# EAGLE design LedKeychain-v2 (EAGLE 7.3.0)
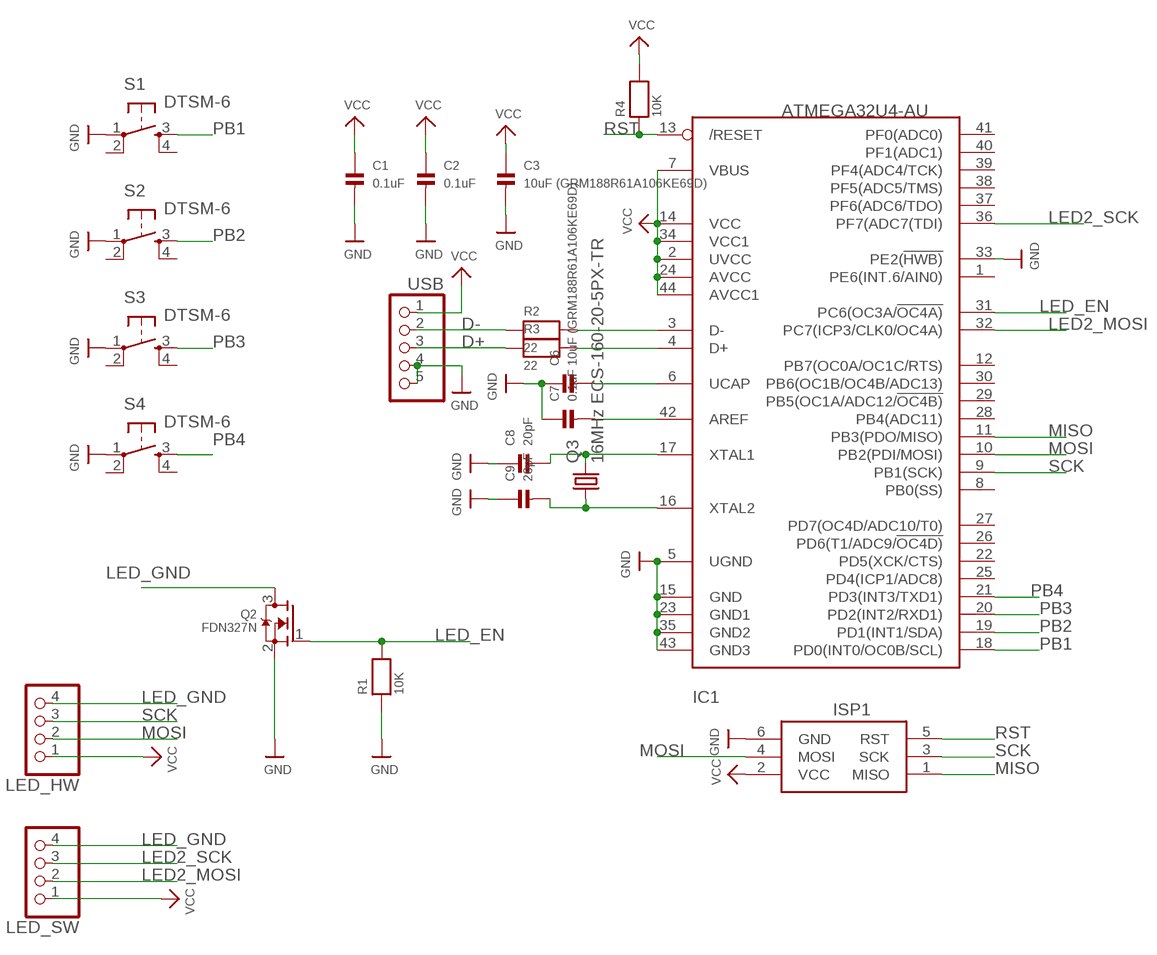
[diagram p0: schematic, sheet 1]

## Parts
C1  0.1uF  CAP_CERAMIC0603MINI  [0603-MINI]
C2  0.1uF  CAP_CERAMIC0603MINI  [0603-MINI]
C3  10uF (GRM188R61A106KE69D)  CAP_CERAMIC1206  [1206]
C6  10uF (GRM188R61A106KE69D)  CAP_CERAMIC1206  [1206]
C7  0.1uF  CAP_CERAMIC0603MINI  [0603-MINI]
C8  20pF  CAP_CERAMIC0603MINI  [0603-MINI]
C9  20pF  CAP_CERAMIC0603MINI  [0603-MINI]
IC1  ATMEGA32U4-AU  [TQFP44]
ISP1  AVRISP-6  [AVRISP]
LED_HW  HEADER-1X4ROUND  [1X04_ROUND]
LED_SW  HEADER-1X4ROUND  [1X04_ROUND]
Q2  FDN327N  MOSFET-NWIDE  [SOT23-WIDE]
Q3  16MHz ECS-160-20-5PX-TR  CRYSTALHC49UP  [HC49UP]
R1  10K  RESISTOR0603MINI  [0603-MINI]
R2  22  RESISTOR0603MINI  [0603-MINI]
R3  22  RESISTOR0603MINI  [0603-MINI]
R4  10K  RESISTOR0603MINI  [0603-MINI]
S1  DTSM-6  [DTSM-6]
S2  DTSM-6  [DTSM-6]
S3  DTSM-6  [DTSM-6]
S4  DTSM-6  [DTSM-6]
USB  PINHD-1X5/90  [1X05/90]

## Nets
D+: R3.1 USB.3
D-: R2.1 USB.2
GND: C1.2 C2.2 C3.2 C6.1 C7.1 C8.1 C9.1 IC1.5(UGND) IC1.15(GND) IC1.23(GND1) IC1.33(PE2(!HWB)) IC1.35(GND2) IC1.43(GND3) ISP1.6(GND) Q2.2(S) R1.1 S1.1 S2.1 S3.1 S4.1 USB.4 USB.5
LED2_MOSI: IC1.32(PC7(ICP3/CLK0/OC4A)) LED_SW.2
LED2_SCK: IC1.36(PF7(ADC7(TDI)) LED_SW.3
LED_EN: IC1.31(PC6(OC3A/!OC4A)) Q2.1(G) R1.2
LED_GND: LED_HW.4 LED_SW.4 Q2.3(D)
MISO: IC1.11(PB3(PDO/MISO)) ISP1.1(MISO)
MOSI: IC1.10(PB2(PDI/MOSI)) ISP1.4(MOSI) LED_HW.2
N$3: IC1.3(D-) R2.2
N$4: IC1.4(D+) R3.2
N$5: C6.2 IC1.6(UCAP)
N$6: C7.2 IC1.42(AREF)
N$7: C9.2 IC1.16(XTAL2) Q3.1
N$8: C8.2 IC1.17(XTAL1) Q3.2
PB1: IC1.18(PD0(INT0/OC0B/SCL)) S1.3
PB2: IC1.19(PD1(INT1/SDA)) S2.3
PB3: IC1.20(PD2(INT2/RXD1)) S3.3
PB4: IC1.21(PD3(INT3/TXD1)) S4.3
RST: IC1.13(/RESET) ISP1.5(RST) R4.1
SCK: IC1.9(PB1(SCK)) ISP1.3(SCK) LED_HW.3
VCC: C1.1 C2.1 C3.1 IC1.2(UVCC) IC1.7(VBUS) IC1.14(VCC) IC1.24(AVCC) IC1.34(VCC1) IC1.44(AVCC1) ISP1.2(VCC) LED_HW.1 LED_SW.1 R4.2 USB.1
Unconnected: IC1.1(PE6(INT.6/AIN0)) IC1.8(PB0(SS)) IC1.12(PB7(OC0A/OC1C/RTS)) IC1.22(PD5(XCK/CTS)) IC1.25(PD4(ICP1/ADC8)) IC1.26(PD6(T1/ADC9/!OC4D)) IC1.27(PD7(OC4D/ADC10/T0)) IC1.28(PB4(ADC11)) IC1.29(PB5(OC1A/ADC12/!OC4B)) IC1.30(PB6(OC1B/OC4B/ADC13)) IC1.37(PF6(ADC6/TDO)) IC1.38(PF5(ADC5/TMS)) IC1.39(PF4(ADC4/TCK)) IC1.40(PF1(ADC1)) IC1.41(PF0(ADC0)) S1.2 S1.4 S2.2 S2.4 S3.2 S3.4 S4.2 S4.4

## Library data of the parts
C1-C3 C6-C9 = microbuilder:CAP_CERAMIC: Ceramic Capacitors 0402 - 0402 Surface Mount Capacitors 16pF 50V 5% [Digikey: 445-4899-2-ND] 18pF 50V 5% [Digikey: 490-1281-2-ND] 22pF 50V 5% [Digikey: 490-1283-2-ND] 68pF 50V 5% [Digikey: 490-1289-2-ND] 0.1uF 10V 10% [Digikey: 490-1318-2-ND] 1.0uF 6.3V 10% [Digikey: 490-1320-2-ND] 0603 - 0603 Surface Mount Capacitors 16 pF 50V 5% [Digikey: 445-5051-2-ND] 22 pF 50V [Digikey: PCC220ACVTR-ND] 33 pF 50V 5% [Digikey: 490-1415-1-ND] 56pF 50V 5% [Digikey: 490-1421-1-ND] 220pF 50V 5% [Digikey: 445-1285-1-ND] 680 pF 50V 2200 pF 50V 5% C0G [Digikey: 445-1297-1-ND] 5600 pF 100V 5% X7R [Digikey: 478-3711-1-ND] 0.1 µF 25V 10% [Digikey: PCC2277TR-ND] 0.22 µF 16V 10% X7R [Digikey: 445-1318-1-ND] 1.0 µF 25V 10% [Digikey: 445-5146-2-ND] 0603 - RF Specific 3pF 250V +/-0.1pF RF [Digikey: 712-1347-1-ND] 18 pF 250V 5% [Digikey: 478-3505-1-ND or 712-1322-1-ND] 56 pF 250V 5% C0G RF [Digikey: 490-4867-1-ND] 68 pF 250V RF [Digikey: 490-4868-1-ND] 0805 - 0805 Surface Mount Capacitors 220 pF 250V 2% RF Ceramic Capacitor [Digikey: 712-1398-1-ND] 1000 pF 50V 2% NP0 Ceramic Capacitor [Digikey: 478-3760-1-ND] 0.1 µF 25V 10% Ceramic Capacitor [Digikey: PCC1828TR-ND] 1.0 µF 16V 10% Ceramic Capacitor[Digikey: 490-1691-2-ND] 10.0 µF 10V 10% Ceramic Capacitor[Digikey: 709-1228-1-ND] 10.0 uF 16V 10% Ceramic Capacitor [Digikey: 478-5165-2-ND] 47 uF 6.3V 20% Ceramic Capacitor [Digikey: 587-1779-1-ND or 399-5506-1-ND] 1206 - 1206 Surface Mount Capacitors 47uF 10V 20% Ceramic Capacitor [Digikey: 490-5528-1-ND or 399-5508-1-ND or 445-6010-1-ND] 100uF 6.3V -20%, +80% Y5V Ceramic Capacitor (Digikey: 490-4512-1-ND, Mouser: 81-GRM31CF50J107ZE1L)
IC1 = adafruit:ATMEGA32U4: http://www.ladyada.net/library/eagle
ISP1 = adafruit:AVRISP: AVR ISP HEADER Standard 6 pin header for AVR programming
LED_HW LED_SW = microbuilder:HEADER-1X4: PIN HEADER
Q2 = microbuilder:MOSFET-N: N-Channel Mosfet LEGEND VDS: Voltage Drain-Source ID: Drain Current RDS(ON): Drain-Source On-State Resistance VGS(TH): Gate-Source Threshold Voltage CISS: Drain-Source Input Capacitance SOT-23 Name VDS ID RDS(ON) VGS(TH) CISS Order Number 2N7002E 60V 260mA 2.5 Ohm 2.5V @ 250uA 26.7pF @ 25V 2N7002ET1GOSTR-ND BSH103 30V 850mA 400 mOhm 400mV @ 1mA 83pF @ 24V BSH103,235-ND BSS138 60V 320mA 1.6 Ohm 1.5V @ 250uA 50pF @ 10V Mouser: 771-BSS138PW115 DMN2075U-7 20V 4.2A 38 mOhm 1V @ 250 uA 594.3pF @ 10V DMN2075U-7DICT-ND * BSS138 good choice for I2C level-shifting
Q3 = adafruit:CRYSTAL: CRYSTAL; OC_FARNELL: unknown; OC_NEWARK: unknown
R1-R4 = microbuilder:RESISTOR: Resistors 0402 - 0402 Surface Mount Package 22 Ohm 1% 1/16W [Digikey: 311-22.0LRTR-ND] 33 Ohm 5% 1/16W 1.0K 5% 1/16W 1.5K 5% 1/16W 2.0K 1% 1/16W 10.0K 1% 1/16W [Digikey: 311-10.0KLRTR-ND] 10.0K 5% 1/16W [Digikey: RMCF0402JT10K0TR-ND] 12.1K 1% 1/16W [Digikey: 311-22.0LRTR-ND] 100.0K 5% 1/16W 0603 - 0603 Surface Mount Package 0 Ohm 1/10 Watt 1% Resistor 15 Ohm 1/10 Watt 1% Resistor 33 Ohm 1/10 Watt 1% Resistor 49.9 Ohm 1/10 Watt 1% Resistor 100 Ohm 1/10 Watt 1% Resistor 150 Ohm 1/10 Watt 1% Resistor 240 Ohm 1/10 Watt 1% Resistor 390 Ohm 1/10 Watt 1% Resistor 560 Ohm 1/10 Watt 1% Resistor 680 Ohm 1/10 Watt 1% Resistor 750 Ohm 1/10 Watt 1% Resistor 1.0K Ohm 1/10 Watt 1% Resistor 1.5K Ohm 1/10 Watt 1% Resistor 2.0K Ohm 1/10 Watt 1% Resistor 2.2K Ohm 1/10 Watt 1% Resistor 3.3K Ohm 1/10 Watt 1% Resistor 4.7K Ohm 1/10 Watt 1% Resistor 10.0K Ohm 1/10 Watt 1% Resistor 12.0K Ohm 1/10 Watt 1% Resistor 12.1K Ohm 1/10 Watt 1% Resistor 20.0K Ohm 1/10 Watt 1% Resistor 33.0K Ohm 1/10 Watt 1% Resistor 100.0K Ohm 1/10 Watt 1% Resistor 0805 - 0805 Surface Mount Package 0 Ohm 1/8 Watt 1% Resistor 33 Ohm 1/8 Watt 1% Resistor 100 Ohm 1/8 Watt 1% Resistor 150 Ohm 1/8 Watt 1% Resistor 200 Ohm 1/8 Watt 1% Resistor 240 Ohm 1/8 Watt 1% Resistor 330 Ohm 1/8 Watt 1% Resistor 390 Ohm 1/8 Watt 1% Resistor 470 Ohm 1/8 Watt 1% Resistor 1.0K Ohm 1/8 Watt 1% Resistor 1.5K Ohm 1/8 Watt 1% Resistor 2.0K Ohm 1/8 Watt 1% Resistor 4.7K Ohm 1/8 Watt 1% Resistor 5.1K Ohm 1/8 Watt 1% Resistor 5.6K Ohm 1/8 Watt 1% Resistor 10.0K Ohm 1/8 Watt 1% Resistor 22.0K Ohm 1/8 Watt 1% Resistor 33.0K Ohm 1/8 Watt 1% Resistor 100K Ohm 1/8 Watt 1% Resistor 1206 - 1206 Surface Mount Package 2012 - 2010 Surface Mount Package 0.11 Ohm 1/2 Watt 1% Resistor - Digikey: RHM.11UCT-ND
S1-S4 = switch-tact:DTSM-6
USB = pinhead:PINHD-1X5: PIN HEADER

## Board
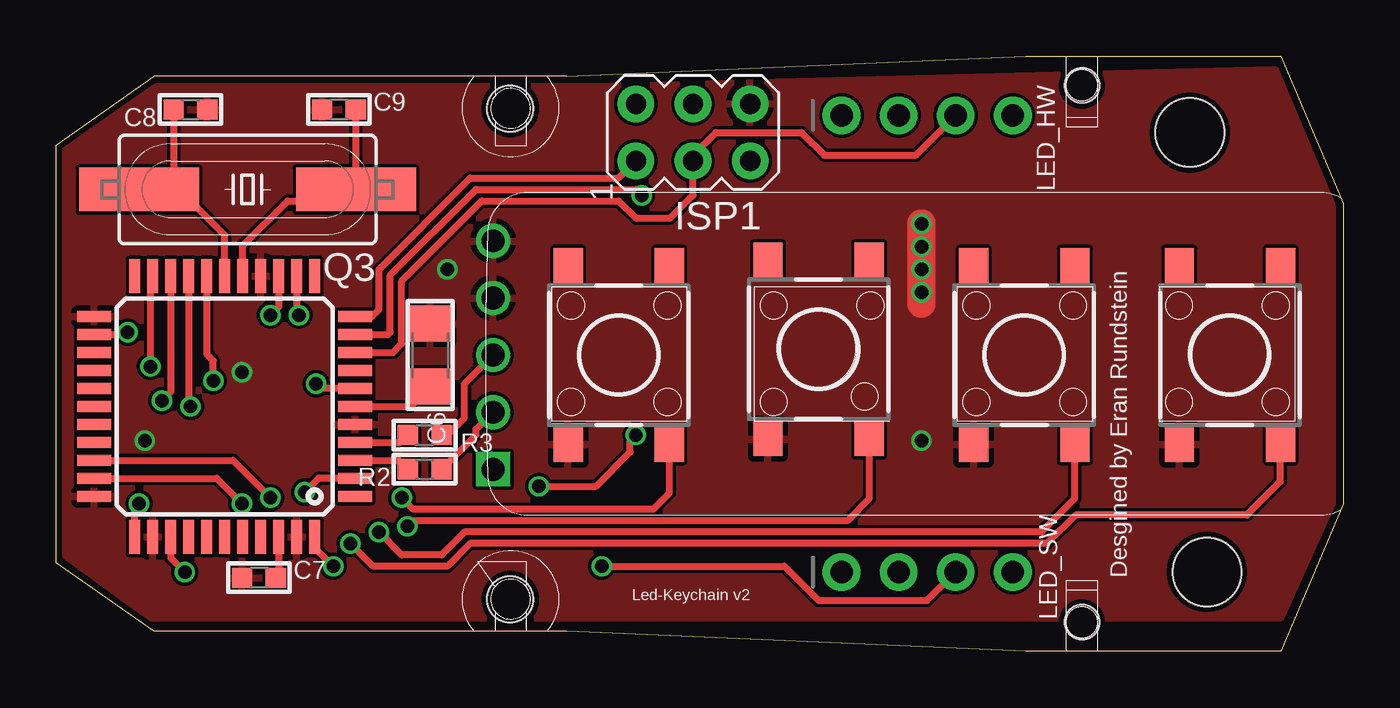
[diagram p1: board, top side]
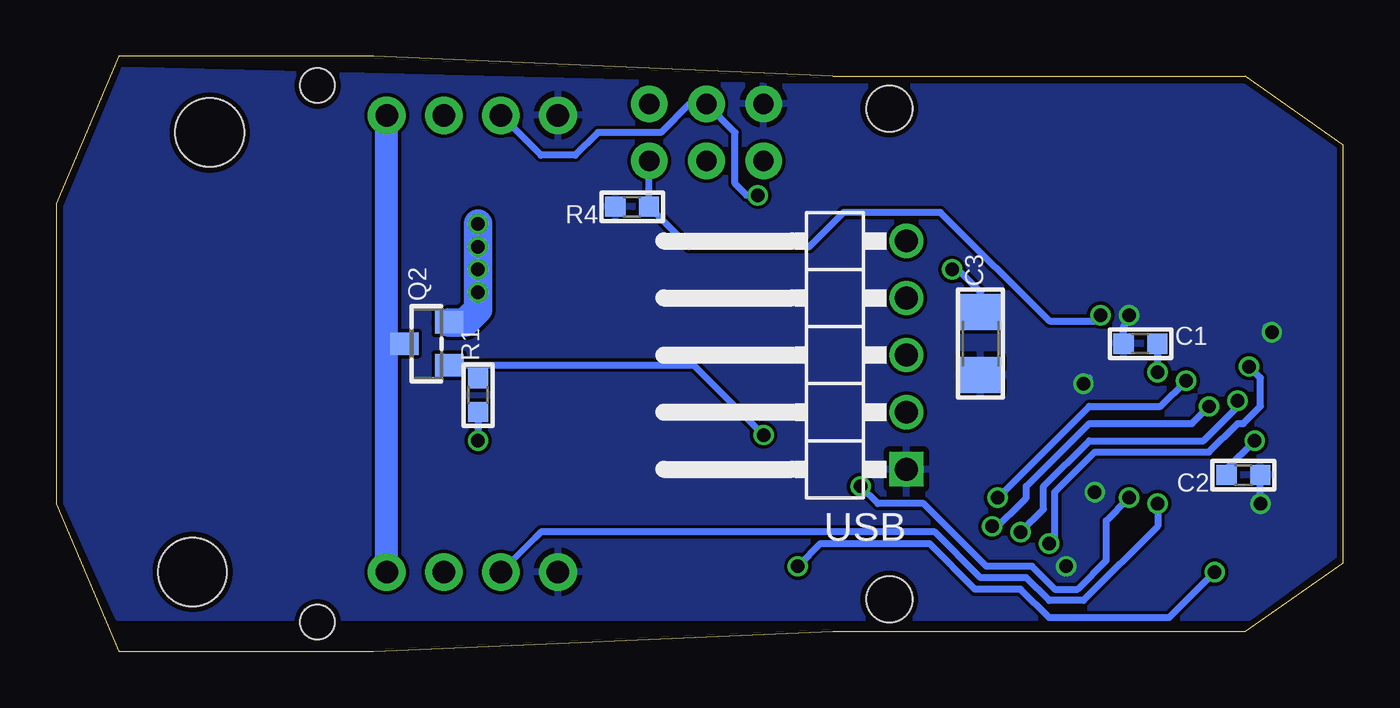
[diagram p2: board, bottom side, seen from below]

Size 57.24 x 26.48 mm. Coordinates in mm from the lower left corner, seen from the top.
Outline: 46.33,26.48 54.46,26.48 57.24,19.93 57.24,6.55 54.46,0 46.33,0
Outline: 44.91,0 43.13,0 22.7,0.9 4.35,0.9 0,3.95 0,22.53 4.35,25.58
Outline: 22.7,25.58 43.13,26.48 44.91,26.48
Outline: 46.32,0 44.92,0
Outline: 44.92,26.48 46.32,26.48
Outline: 22.7,25.59 4.35,25.59
Copper layers (1*16): Top 0.035mm / dielectric 1.5mm / Bottom 0.035mm
Design rules "MacroFab_Standard_2_Layer *": minimum track width 6mil, minimum drill 12mil, track to track 6mil, track to pad 6mil, pad to pad 6mil, via to via 6mil, smd to smd 0mil, copper to edge 10mil, drill to drill 10mil, minimum pad ring 6mil, minimum via ring 6mil, stop-mask expansion 2mil, vias tented up to drill 25mil, thermal gap 10mil
Holes 2.03 mm at 20.19,24.15 20.19,2.31
Holes 1.52 mm at 45.62,1.29 45.62,25.17
Holes 3.05 mm at 50.42,23.09 51.18,3.53

### Footprints (pad centres in the part's own frame; a part is rotated, then mirrored left to right if it is on the bottom)
0603-MINI = smd 0.9 x 0.9: 1 -0.75,0; 2 0.75,0
1206 = smd 1.6 x 1.8: 1 -1.4,0; 2 1.4,0
TQFP44 = smd 1.5 x 0.5: 1 -5.8,4; 2 -5.8,3.2; 3 -5.8,2.4; 4 -5.8,1.6; 5 -5.8,0.8; 6 -5.8,0; 7 -5.8,-0.8; 8 -5.8,-1.6; 9 -5.8,-2.4; 10 -5.8,-3.2; 11 -5.8,-4; 23 5.8,-4; 24 5.8,-3.2; 25 5.8,-2.4; 26 5.8,-1.6; 27 5.8,-0.8; 28 5.8,0; 29 5.8,0.8; 30 5.8,1.6; 31 5.8,2.4; 32 5.8,3.2; 33 5.8,4 | smd 0.5 x 1.5: 12 -4,-5.8; 13 -3.2,-5.8; 14 -2.4,-5.8; 15 -1.6,-5.8; 16 -0.8,-5.8; 17 0,-5.8; 18 0.8,-5.8; 19 1.6,-5.8; 20 2.4,-5.8; 21 3.2,-5.8; 22 4,-5.8; 34 4,5.8; 35 3.2,5.8; 36 2.4,5.8; 37 1.6,5.8; 38 0.8,5.8; 39 0,5.8; 40 -0.8,5.8; 41 -1.6,5.8; 42 -2.4,5.8; 43 -3.2,5.8; 44 -4,5.8
AVRISP = drill 0.9 pad 1.626: 1 -1.27,2.54; 2 1.27,2.54; 3 -1.27,0; 4 1.27,0; 5 -1.27,-2.54; 6 1.27,-2.54
1X04_ROUND = drill 1 pad 1.676: 1 -3.81,0; 2 -1.27,0; 3 1.27,0; 4 3.81,0
SOT23-WIDE = smd 1 x 1.27: 1 -0.95,-1; 2 0.95,-1; 3 0,1
HC49UP = smd 5.334 x 1.93: 1 -4.826,0; 2 4.826,0
DTSM-6 = smd 1.55 x 1.3: 1 -3.975,2.25; 2 3.975,2.25; 3 -3.975,-2.25; 4 3.975,-2.25
1X05/90 = drill 1.016 square: 1 -5.08,-3.81 | drill 1.016: 2 -2.54,-3.81; 3 0,-3.81; 4 2.54,-3.81; 5 5.08,-3.81

### Placement (x,y rotation side)
C1  9.02,13.69 0 bottom
C2  4.45,7.85 180 bottom
C3  16.13,13.69 90 bottom
C6  16.64,13.18 270 top
C7  9.02,3.28 0 top
C8  5.97,24.1 180 top
C9  12.57,24.1 0 top
IC1  7.49,10.9 180 top
ISP1  28.32,23.09 90 top
LED_HW  38.74,23.85 0 top
LED_SW  38.74,3.53 0 top
Q2  40.77,13.69 90 bottom
Q3  8.51,20.55 180 top
R1  38.48,11.4 90 bottom
R2  16.38,8.1 180 top
R3  16.38,9.63 180 top
R4  31.62,19.79 180 bottom
S1  25.02,13.18 90 top
S2  33.91,13.44 90 top
S3  43.05,13.18 90 top
S4  52.2,13.18 90 top
USB  23.24,13.18 90 bottom

### Tracks (layer width: path | path; a pad name or v marks a point on that pad's centre or on a via)
D+
  Top 0.305: R3.1 17.4,9.63 18.16,10.39 18.16,11.91 USB.3
D-
  Top 0.305: R2.1 18.67,9.63 18.67,9.88 USB.2
GND  (via drill 0.6)
  Top 0.305: v8.26,12.42 8.26,12.17 | v3.94,9.37 3.68,9.37 | v38.48,9.37 38.48,9.12 | v17.4,16.99 17.65,16.99
  Top 1.27: v38.48,19.02 v38.48,18.01 v38.48,16.99 v38.48,15.98 38.48,15.47
  Bottom 0.305: C1.2 8.27,12.43 v8.26,12.42 | C2.2 5.2,8.11 v3.94,9.37 | R1.1 v38.48,9.37 | C3.2 16.13,15.98 17.15,16.99 v17.4,16.99
  Bottom 1.27: Q2.2 39.06,14.64 38.48,15.21 v38.48,15.98 v38.48,16.99 v38.48,18.01 v38.48,19.02
  pour Top: 0.38,22.33 0.38,4.29 4.19,1.5 54.48,1.5 56.77,6.58 56.77,19.79 54.23,25.88 24,25.12 4.45,25.12
LED2_MOSI  (via drill 0.6)
  Top 0.305: IC1.32 7.14,7.7 v8.26,6.58
  Bottom 0.254: LED_SW.2 35.94,5.05
  Bottom 0.305: v8.26,6.58 8.26,5.56 11.56,2.26 13.08,2.26 14.1,3.28 16.13,3.28 18.16,5.31 35.69,5.31 35.94,5.05
LED2_SCK  (via drill 0.6)
  Top 0.305: IC1.36 5.09,4.15 v5.72,3.53 | v24.26,3.78 32.39,3.78 33.91,2.26 38.74,2.26 LED_SW.3
  Bottom 0.305: v5.72,3.53 7.75,1.5 13.08,1.5 14.35,2.77 16.38,2.77 18.42,4.8 23.24,4.8 v24.26,3.78
LED_EN  (via drill 0.6)
  Top 0.305: IC1.31 7.86,8.5 v9.53,6.83 | v25.78,9.63 25.53,9.37 25.53,8.86 24,7.34 v21.46,7.34
  Bottom 0.305: v9.53,6.83 10.54,5.82 10.54,4.04 11.81,2.77 12.83,2.77 13.84,3.78 15.88,3.78 18.67,6.58 20.7,6.58 v21.46,7.34 | v25.78,9.63 28.9,12.74 38.48,12.74 | Q2.1 38.48,12.74 | R1.2 38.48,12.74
LED_GND
  Bottom 0.305: Q2.3 42.29,13.69 42.55,13.94
  Bottom 1.016: LED_SW.4 42.55,13.94 LED_HW.4
MISO
  Top 0.305: ISP1.1 25.02,21.06 18.42,21.06 14.35,16.99 14.35,15.21 14.03,14.9 IC1.11
MOSI  (via drill 0.6)
  Top 0.305: v26.04,20.29 25.78,20.55 18.67,20.55 14.86,16.74 14.86,14.2 14.76,14.1 IC1.10
  Bottom 0.305: v26.04,20.29 26.54,20.29 27.05,20.8 27.05,23.09 ISP1.4 29.08,24.36 30.35,23.09 33.15,23.09 34.16,22.07 35.69,22.07 LED_HW.2
N$3
  Top 0.305: IC1.3 15.24,8.5 R2.2
N$4
  Top 0.305: IC1.4 15.3,9.3 R3.2
N$5
  Top 0.305: IC1.6 15.75,10.9 C6.2
N$6
  Top 0.305: IC1.42 9.89,3.4 C7.2
N$7
  Top 0.305: C9.2 13.32,20.56 Q3.1 13.08,20.29 12.83,20.29 12.57,20.04 10.29,20.04 8.29,18.05 IC1.16
N$8
  Top 0.305: IC1.17 7.49,18.52 5.46,20.55 5.21,20.55 | 5.21,20.55 Q3.2 | C8.2 5.22,20.56 5.21,20.55
PB1  (via drill 0.6)
  Top 0.305: v15.37,6.83 15.88,6.32 26.54,6.32 27.27,7.05 27.27,8.96 | v6.99,12.04 6.99,12.93 6.69,13.22 IC1.18
  Top 0.406: S1.3 27.27,8.96
  Bottom 0.305: v15.37,6.83 11.3,10.9 8.13,10.9 v6.99,12.04
PB2  (via drill 0.6)
  Top 0.305: IC1.19 5.89,10.97 v5.97,10.9 | v15.62,5.56 15.88,5.82 35.18,5.82 36.16,6.8 36.16,9.22
  Top 0.406: S2.3 36.16,9.22
  Bottom 0.305: v15.62,5.56 15.62,5.31 14.1,6.83 14.1,7.34 11.3,10.13 6.73,10.13 v5.97,10.9
PB3  (via drill 0.6)
  Top 0.305: v14.35,5.31 15.37,4.29 17.15,4.29 18.16,5.31 43.82,5.31 45.3,6.8 45.3,8.86 | IC1.20 5.09,11.54 v4.7,11.15 | S3.3
  Top 0.406: S3.3 45.3,8.86
  Bottom 0.305: v14.35,5.31 13.34,6.32 13.34,7.34 11.3,9.37 6.22,9.37 4.7,10.9 v4.7,11.15
PB4  (via drill 0.6)
  Top 0.305: v13.08,4.8 14.1,3.78 17.4,3.78 18.42,4.8 44.07,4.8 45.34,6.07 52.96,6.07 54.45,7.56 S4.3 | v4.19,12.67 4.19,16.59 IC1.21
  Top 0.406: S4.3
  Bottom 0.305: v13.08,4.8 12.83,5.05 12.83,7.09 11.05,8.86 5.97,8.86 4.7,10.13 4.45,10.13 3.68,10.9 3.68,12.17 v4.19,12.67
RST  (via drill 0.6)
  Top 0.305: IC1.13 10.69,15.06 v10.8,14.96
  Bottom 0.305: ISP1.5 30.87,21.81 R4.1 29.1,18.01 23.75,18.01 22.23,19.53 17.91,19.53 13.08,14.71 11.05,14.71 v10.8,14.96
SCK
  Top 0.305: IC1.9 14.97,13.3 15.37,13.69 15.37,16.48 18.92,20.04 25.02,20.04 25.78,19.28 27.31,19.28 28.32,20.29 ISP1.3 28.32,22.07 29.34,23.09 33.15,23.09 34.16,22.07 38.23,22.07 LED_HW.3
VCC  (via drill 0.6)
  Top 0.305: IC1.14 9.89,15.33 v9.53,14.96 | IC1.34 3.49,6.39 v3.68,6.58 | IC1.7 11.77,11.7 v11.56,11.91 | IC1.24 3.07,14.1 v3.18,14.2 | IC1.44 11.49,4.61 v12.32,3.78 | IC1.2 11.66,7.7 v11.05,7.09
  Bottom 0.305: C1.1 9.78,13.7 9.78,14.45 9.53,14.71 | v3.68,6.58 3.68,7.84 C2.1 | v11.56,11.91 11.3,12.17 | v3.18,14.2 3.43,14.45 | v11.05,7.09 10.8,7.09
  pour Bottom: 0.38,22.33 0.38,4.29 4.19,1.5 54.48,1.5 56.77,6.58 56.77,19.79 54.23,25.88 24,25.12 4.45,25.12

### Text on the board
tPlace: Led-Keychain v2 | Desgined by Eran Rundstein